# EAGLE schematic BSPD System Schematic (EAGLE 9.6.2)
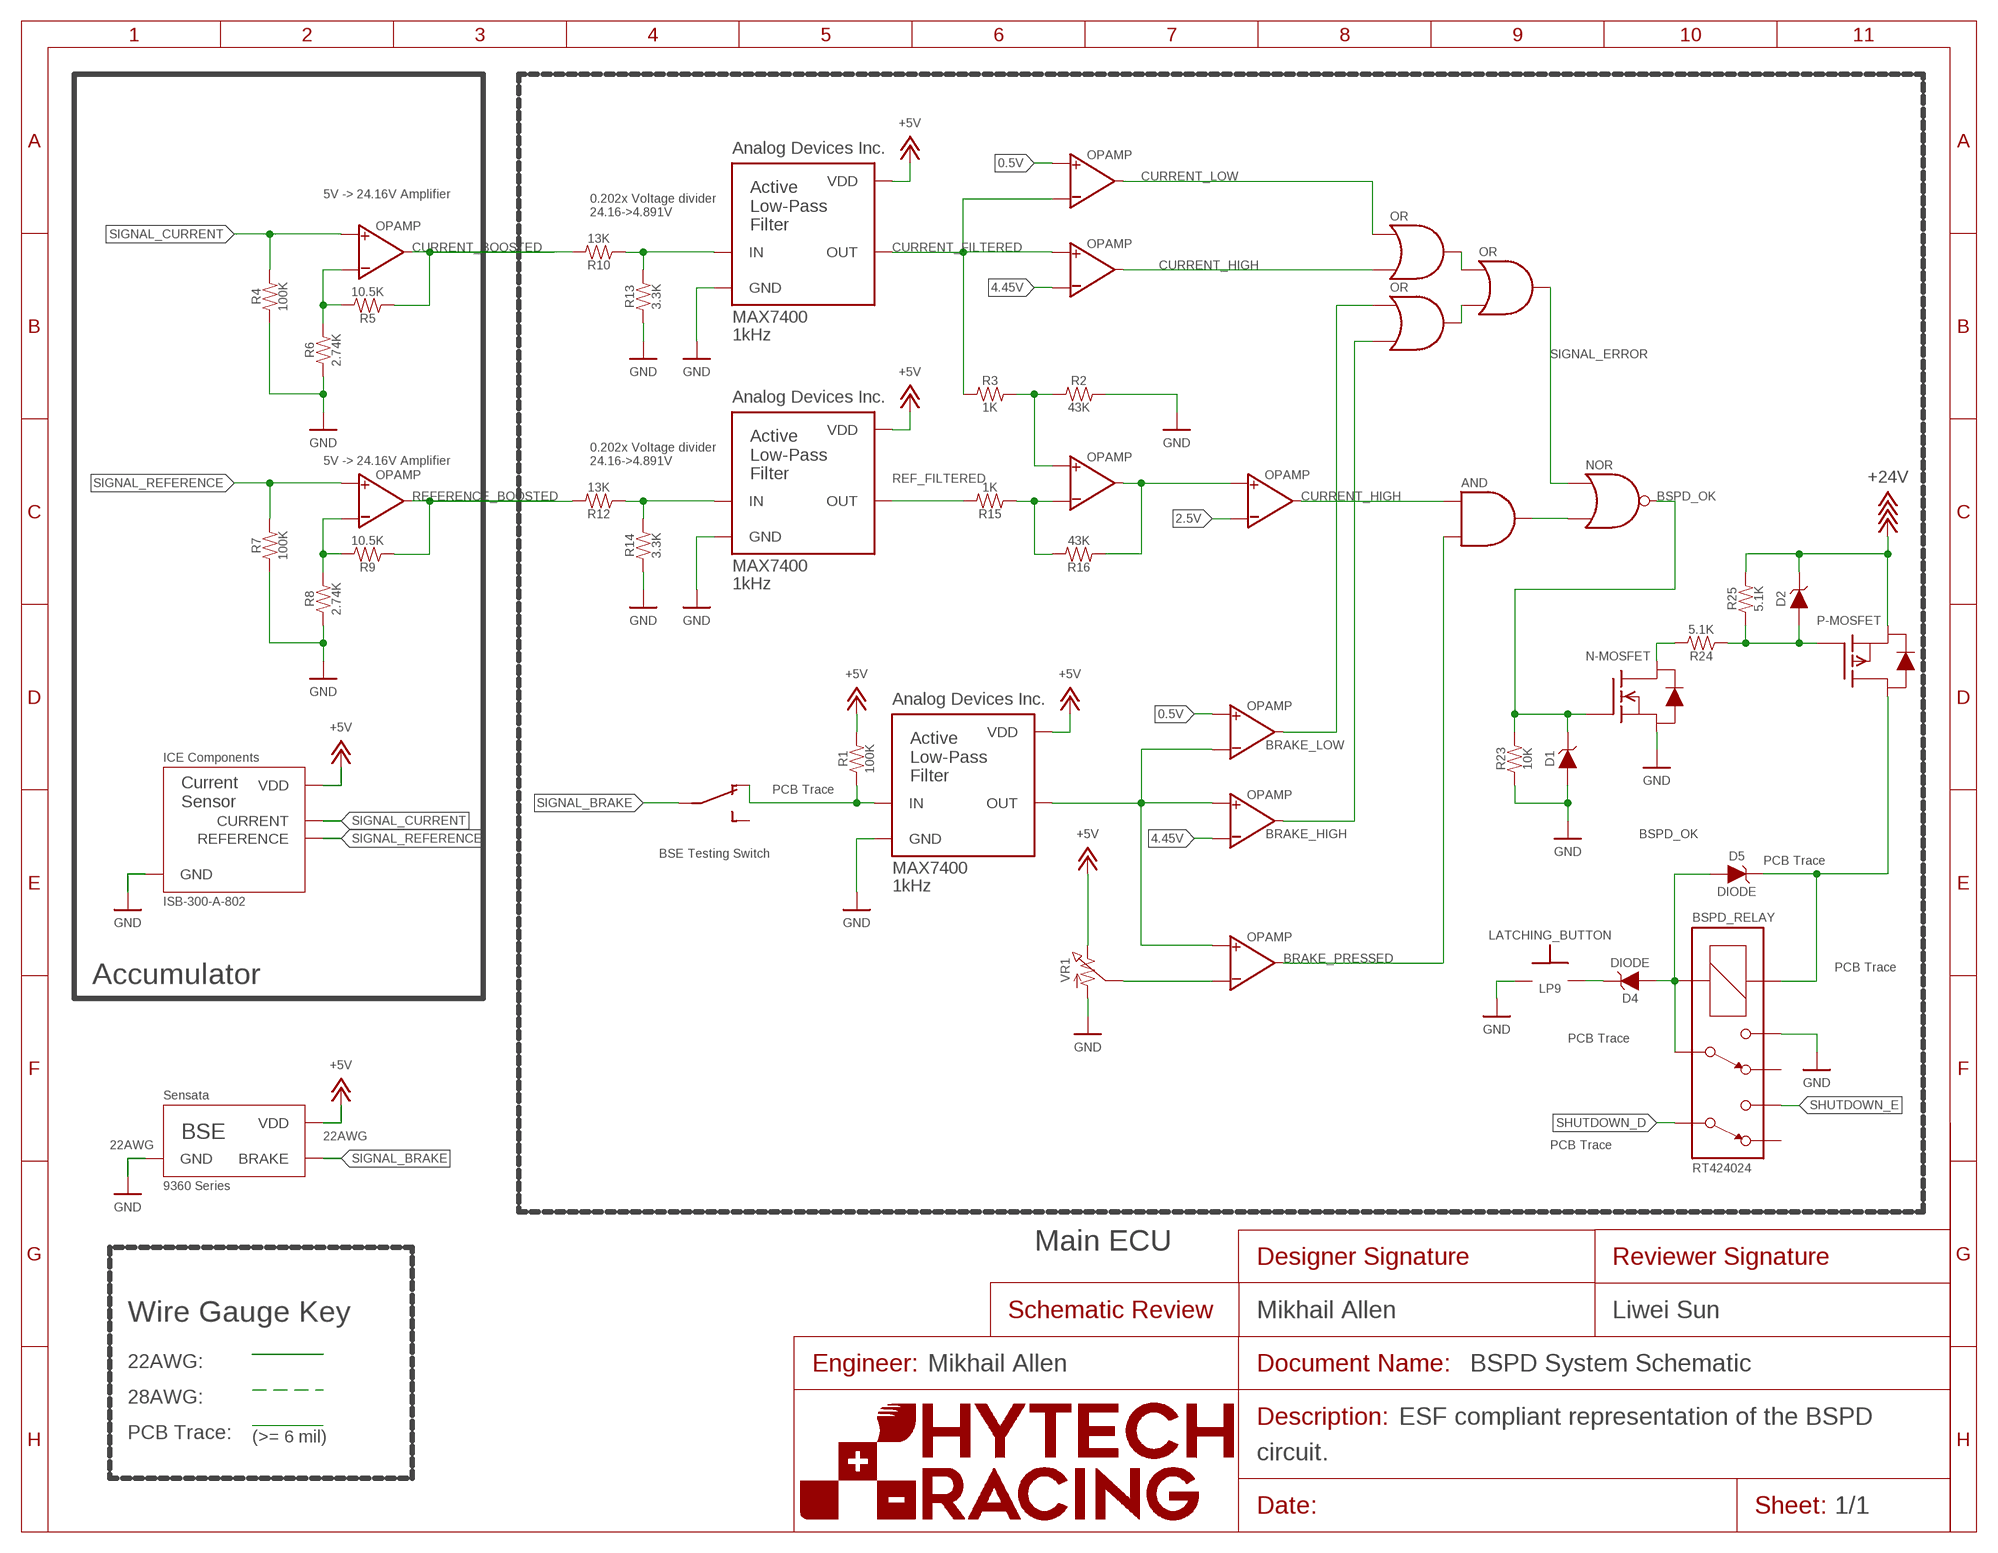
[diagram p0: schematic, sheet 1]
U$5 (FRAME_SCHEMATIC_ONLY): DESCRIPTION_1: ESF compliant representation of the BSPD; DESCRIPTION_2: circuit.; DESIGNER_SCHEMATIC: Mikhail Allen; ENGINEER: Mikhail Allen; REVIEWER_SCHEMATIC: Liwei Sun

## Parts
A1  CURRENT_SENSOR_WITH_REFISB-300-A-802  (no package)
A2  BSE9360  (no package)
BSPD_RELAY  RELAY_DPDT_  (no package)
D1  DIODE  (no package)
D2  DIODE  (no package)
D4  DIODE  (no package)
D5  DIODE  (no package)
LATCHING_BUTTON  BUTTON_NO_LP9  (no package)
Q1  MOSFET_N-CHANNEL  (no package)
Q2  MOSFET_P-CHANNEL  (no package)
R1  100K  RESISTOR  (no package)
R2  43K  RESISTOR  (no package)
R3  1K  RESISTOR  (no package)
R4  100K  RESISTOR  (no package)
R5  10.5K  RESISTOR  (no package)
R6  2.74K  RESISTOR  (no package)
R7  100K  RESISTOR  (no package)
R8  2.74K  RESISTOR  (no package)
R9  10.5K  RESISTOR  (no package)
R10  13K  RESISTOR  (no package)
R12  13K  RESISTOR  (no package)
R13  3.3K  RESISTOR  (no package)
R14  3.3K  RESISTOR  (no package)
R15  1K  RESISTOR  (no package)
R16  43K  RESISTOR  (no package)
R23  10K  RESISTOR  (no package)
R24  5.1K  RESISTOR  (no package)
R25  5.1K  RESISTOR  (no package)
S1  SWITCH_SPST_  (no package)
U1  OPAMP  (no package)
U2  OPAMP  (no package)
U3  OPAMP  (no package)
U4  OPAMP  (no package)
U5  OPAMP  (no package)
U6  OPAMP  (no package)
U7  OPAMP  (no package)
U8  LOGICGATE_OR  (no package)
U9  LOGICGATE_AND  (no package)
U10  LOGICGATE_NOR  (no package)
U11  OPAMP  (no package)
U12  LOGICGATE_OR  (no package)
U13  LOGICGATE_OR  (no package)
U14  OPAMP  (no package)
U$1  FILTER_ACTIVE1KHZ  (no package)
U$2  FILTER_ACTIVE1KHZ  (no package)
U$6  FILTER_ACTIVE1KHZ  (no package)
VR1  RESISTOR_TRIMPOT  (no package)

## Nets
0.5V: U11.VIN+ U14.VIN+
2.5V: U6.VIN-
4.45V: U1.VIN- U7.VIN-
+5V: A1.VDD A2.VDD R1.2 U$1.VDD U$2.VDD U$6.VDD VR1.2
+24V: D2.C Q2.S R25.2
BRAKE_HIGH: U1.VOUT U13.IN2
BRAKE_LOW: U11.VOUT U13.IN1
BRAKE_PRESSED: U2.VOUT U9.IN2
BSPD_OK: BSPD_RELAY.COIL+ D1.C D5.C Q1.G Q2.D R23.2 U10.OUT
CURRENT_BOOSTED: R5.1 R10.2 U3.VOUT
CURRENT_FILTERED: R3.1 U7.VIN+ U14.VIN- U$1.OUT
CURRENT_HIGH: U6.VOUT U7.VOUT U9.IN1 U12.IN2
CURRENT_LOW: U12.IN1 U14.VOUT
GND: A1.GND A2.GND BSPD_RELAY.4 D1.A LATCHING_BUTTON.P$1 Q1.S R2.2 R4.1 R6.1 R7.1 R8.1 R13.1 R14.1 R23.1 U$1.GND U$2.GND U$6.GND VR1.1
N$1: R2.1 R3.2 U5.VIN+
N$3: U2.VIN- VR1.P$1
N$4: D4.C LATCHING_BUTTON.P$2
N$7: R5.2 R6.2 U3.VIN-
N$8: R10.1 R13.2 U$1.IN
N$10: R8.2 R9.2 U4.VIN-
N$11: U9.OUT U10.IN2
N$12: R12.1 R14.2 U$2.IN
N$14: BSPD_RELAY.3 BSPD_RELAY.COIL- D4.A D5.A
N$15: U8.IN1 U12.OUT
N$16: R15.1 R16.2 U5.VIN-
N$17: R16.1 U5.VOUT U6.VIN+
N$18: U8.IN2 U13.OUT
N$19: Q1.D R24.2
N$20: D2.A Q2.G R24.1 R25.1
REF_FILTERED: R15.2 U$2.OUT
REFERENCE_BOOSTED: R9.1 R12.2 U4.VOUT
SHUTDOWN_D: BSPD_RELAY.6
SHUTDOWN_E: BSPD_RELAY.5
SIGNAL_BRAKE: A2.BRAKE R1.1 S1.O S1.P U1.VIN+ U2.VIN+ U11.VIN- U$6.IN U$6.OUT
SIGNAL_CURRENT: A1.CURRENT R4.2 U3.VIN+
SIGNAL_ERROR: U8.OUT U10.IN1
SIGNAL_REFERENCE: A1.REFERENCE R7.2 U4.VIN+
Unconnected: BSPD_RELAY.2 BSPD_RELAY.7 S1.S

## Notes on the sheet
- 5V -> 24.16V Amplifier
- 0.202x Voltage divider
  24.16->4.891V
- 5V -> 24.16V Amplifier
- 0.202x Voltage divider
  24.16->4.891V
- PCB Trace
- BSE Testing Switch
- PCB Trace
- Accumulator | PCB Trace
- PCB Trace
- 22AWG | 22AWG | PCB Trace
- Main ECU
- Wire Gauge Key
- 22AWG:
- 28AWG:
- PCB Trace:
- (>= 6 mil)

## Library data of the parts
A1 = HyTechSymbols:CURRENT_SENSOR_WITH_REF: Current sensor ISB-100-A-802 <https://drive.google.com/file/d/1TFe_k71_-CaaeTxBeJvnXcb4MXyxoknx/view>; MANUFACTURER: ICE Components; MPN: ISB-300-A-802
A2 = HyTechSymbols:BSE: Brake system encoder M3031-000005-2K5PG <https://www.mouser.com/datasheet/2/418/6/ENG_DS_MSP300_B-1130121.pdf>; MANUFACTURER: Sensata; MPN: 9360 Series
BSPD_RELAY = HyTechSymbols:RELAY_DPDT_?*: Dual pole dual throw relay RT424009 <https://drive.google.com/file/d/12KcB2gZ1-F85lC-w8KP3F9yHGxVaqaUc/view>; MPN: RT424024
D1 D2 = HyTechSymbols:DIODE
D4 D5 = HyTechSymbolsTemp:DIODE
LATCHING_BUTTON = HyTechSymbolsTemp:BUTTON_NO_*: Normally open pushbutton OTTO P9 Series Pushbutton Switches <https://www.mouser.com/datasheet/2/603/P9_Sealed_Dome_Pushbuttons_Catalog_Pages-2576938.pdf> OTTO LP9 Series Illuminated Pushbutton Switches <https://www.otto-controls.com/-/media/products/electromechanical-switches/pushbuttonswitches/lp9illuminatedsealedmomentaryactionpushbuttonswitch/LP9-Pushbuttons-Catalog-Pages.ashx>; MANUFACTURER: OTTO; MPN: LP9
Q1 = HyTechSymbols:MOSFET_N-CHANNEL
Q2 = HyTechSymbols:MOSFET_P-CHANNEL
R1-R10 R12-R16 R23-R25 = HyTechSymbols:RESISTOR
S1 = HyTechSymbols:SWITCH_SPST_*: Single Pull Single Throw Switch EAO Series 61 27mm Illuminated Emergency Stop Swtich <https://eao.com/fileadmin/documents/PDFs/en/03_brochures/EAO_PB_61_E-Stop_Compact_EN.pdf> EAO Series 45 40mm Illuminated Emergency Stop Swtich <https://hmi.eao.com/p/965f6719> EAO Series 45 34mm Illuminated Emergency Stop Switch <https://hmi.eao.com/p/5909b34f> TE Battery Disconnector Switch <https://www.mouser.com/datasheet/2/418/8/ENG_CD_35_210_100_R_900_5-2533843.pdf>
U1-U7 U11 U14 = HyTechSymbols:OPAMP
U8 U12 U13 = HyTechSymbols:LOGICGATE_OR
U9 = HyTechSymbols:LOGICGATE_AND
U10 = HyTechSymbols:LOGICGATE_NOR
U$1 U$2 U$6 = HyTechSymbols:FILTER_ACTIVE; FREQ: 1kHz; MANUFACTURER: Analog Devices Inc.; MPN: MAX7400
VR1 = HyTechSymbols:RESISTOR_TRIMPOT